# EAGLE design CO2 measurement module (EAGLE 5.03)
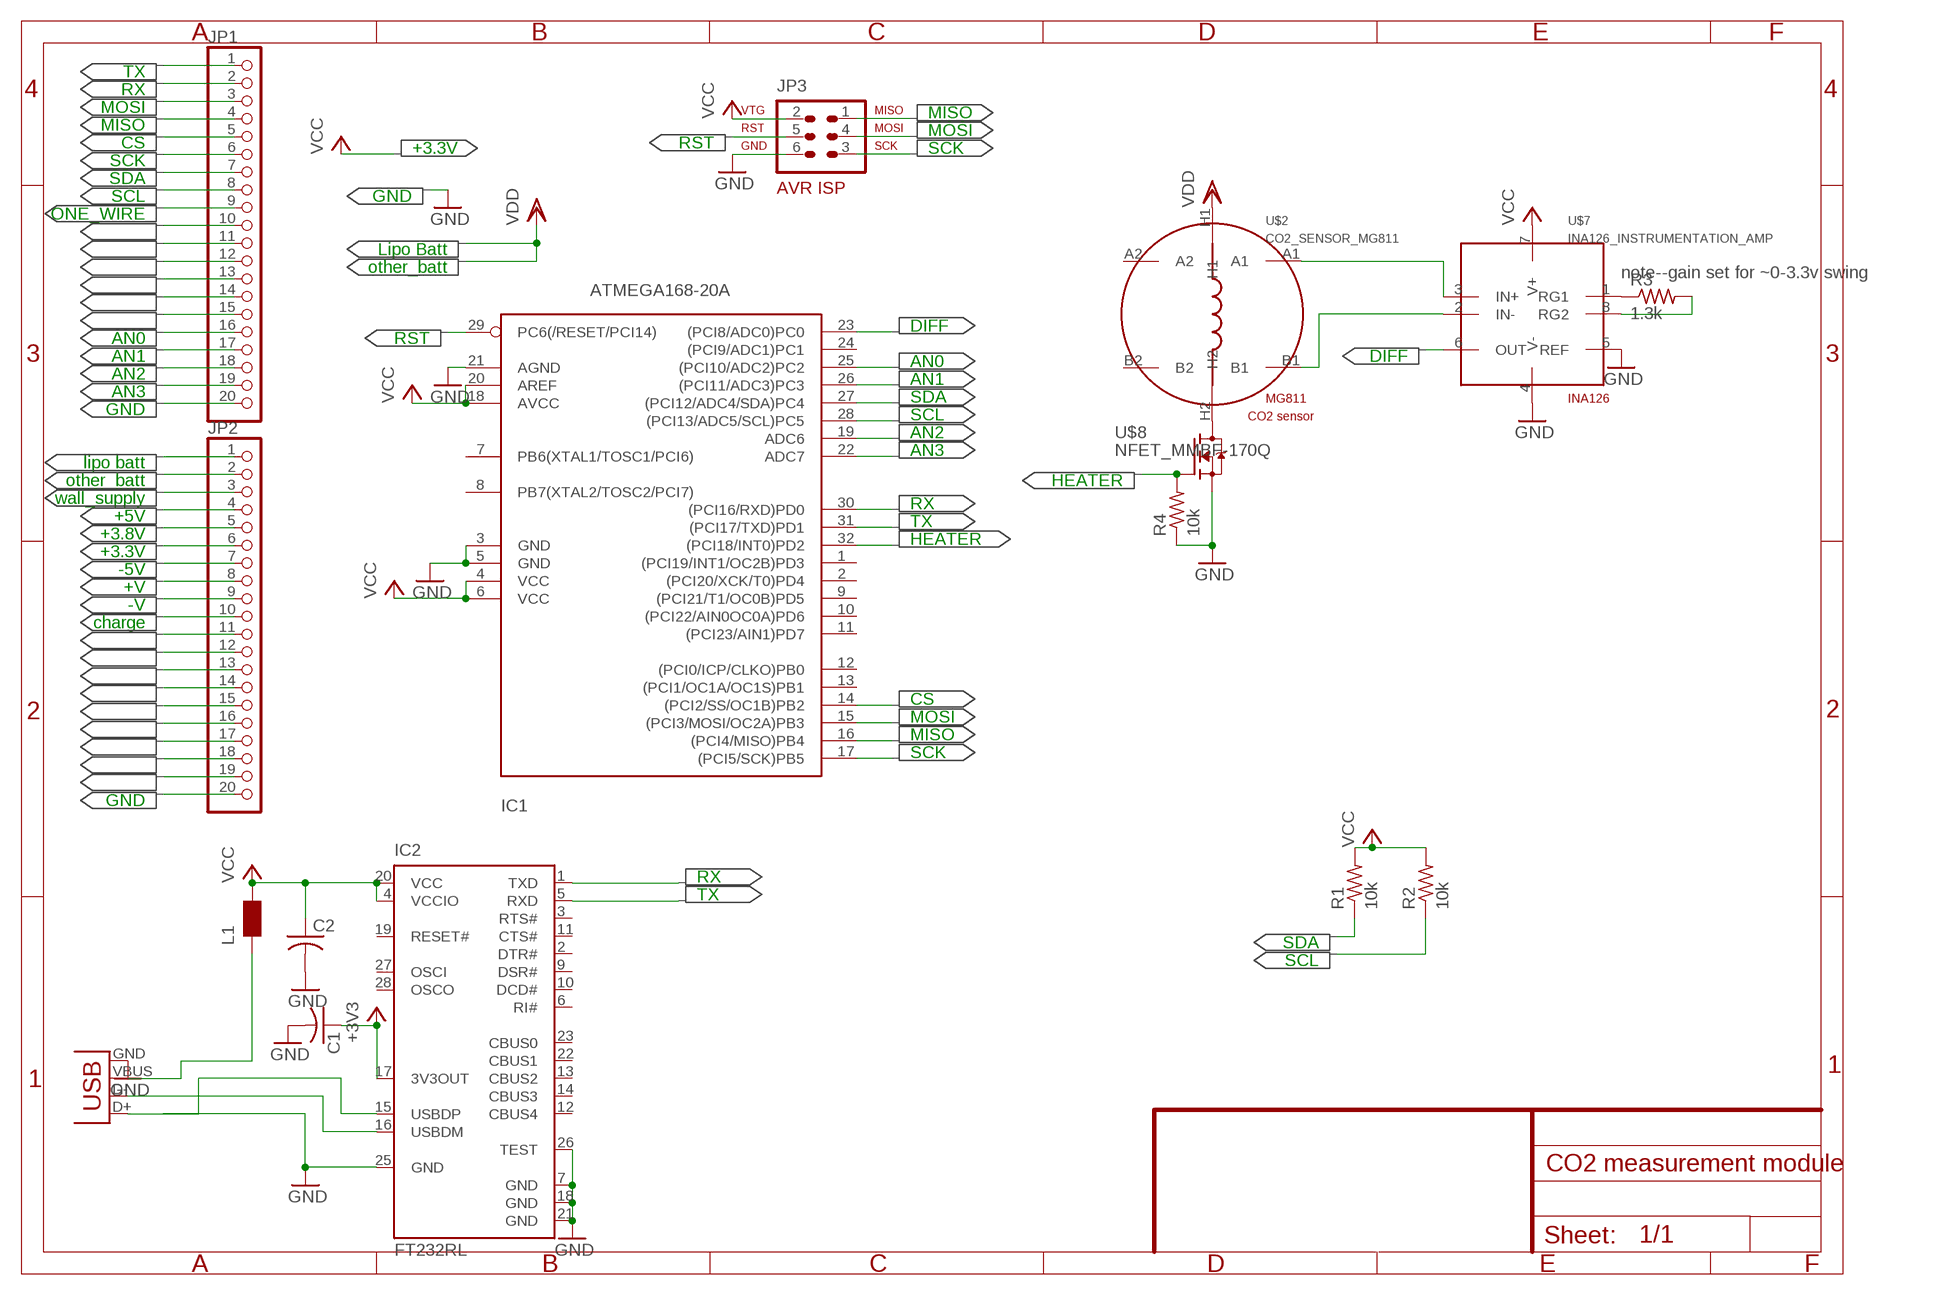
[diagram p0: schematic, sheet 1]

## Parts
C1  C-USC0603  [C0603]
C2  C-USC0603  [C0603]
IC1  ATMEGA168-20A  [TQFP32-08]
IC2  FT232RL  [SSOP28]
JP1  PINHD-1X20  [1X20]
JP2  PINHD-1X20  [1X20]
JP3  AVR-ISP-6  [AVR-ISP-6]
L1  WE-CBF_0603  [0603]
R1  10k  R-US_R0603  [R0603]
R2  10k  R-US_R0603  [R0603]
R3  1.3k  R-US_R0603  [R0603]
R4  10k  R-US_R0603  [R0603]
U$2  CO2_SENSOR_MG811  [MG811]
U$7  INA126_INSTRUMENTATION_AMP  [SO8]
U$8  NFET_MMBF-170Q  [SOT23]
X1  USBPTH  [USB-B-PTH]

## Nets
+3.3V: JP2.6
+3V3: C1.1 IC2.17(3V3OUT)
+5V: JP2.4
+V: JP2.8
-5V: JP2.7
-V: JP2.9
ALARM: JP1.14
AN0: IC1.25((PCI10/ADC2)PC2) JP1.16
AN1: IC1.26((PCI11/ADC3)PC3) JP1.17
AN2: IC1.19(ADC6) JP1.18
AN3: IC1.22(ADC7) JP1.19
CD: JP1.10
CHARGE: JP2.10
CS: IC1.14((PCI2/SS/OC1B)PB2) JP1.5
DIFF: IC1.23((PCI8/ADC0)PC0) U$7.6(OUT)
GND: C1.2 C2.2 IC1.3(GND) IC1.5(GND) IC1.21(AGND) IC2.7(GND) IC2.18(GND) IC2.21(GND) IC2.25(GND) IC2.26(TEST) JP1.20 JP2.20 JP3.6 R4.1 U$7.4(V-) U$7.5(REF) U$8.2(S) X1.GND
HEATER: IC1.32((PCI18/INT0)PD2) R4.2 U$8.1(G)
LOG: JP1.12
MISO: IC1.16((PCI4/MISO)PB4) JP1.4 JP3.1
MOSI: IC1.15((PCI3/MOSI/OC2A)PB3) JP1.3 JP3.4
N$1: JP2.11
N$2: U$2.A1 U$7.3(IN+)
N$3: U$2.B1 U$7.2(IN-)
N$5: R3.1 U$7.1(RG1)
N$6: JP2.12
N$7: JP2.13
N$8: IC2.15(USBDP) X1.D+
N$9: IC2.16(USBDM) X1.D-
N$11: JP2.14
N$12: JP2.15
N$13: JP2.16
N$14: JP2.17
N$15: JP2.18
N$16: JP2.19
N$17: R3.2 U$7.8(RG2)
N$18: U$2.H2 U$8.3(D)
N$19: L1.1 X1.VBUS
N$32: JP1.15
ONE_WIRE: JP1.9
RIN: JP1.13
RST: IC1.29(PC6(/RESET/PCI14)) JP3.5
RX: IC1.30((PCI16/RXD)PD0) IC2.1(TXD) JP1.2
SCK: IC1.17((PCI5/SCK)PB5) JP1.6 JP3.3
SCL: IC1.28((PCI13/ADC5/SCL)PC5) JP1.8 R2.1
SDA: IC1.27((PCI12/ADC4/SDA)PC4) JP1.7 R1.1
SW: JP1.11
TX: IC1.31((PCI17/TXD)PD1) IC2.5(RXD) JP1.1
VCC: C2.1 IC1.4(VCC) IC1.6(VCC) IC1.18(AVCC) IC1.20(AREF) IC2.4(VCCIO) IC2.20(VCC) JP2.5 JP3.2 L1.2 R1.2 R2.2 U$7.7(V+)
VDD: JP2.1 JP2.2 U$2.H1
WALL_SUPPLY: JP2.3
Unconnected: IC1.1((PCI19/INT1/OC2B)PD3) IC1.2((PCI20/XCK/T0)PD4) IC1.7(PB6(XTAL1/TOSC1/PCI6)) IC1.8(PB7(XTAL2/TOSC2/PCI7)) IC1.9((PCI21/T1/OC0B)PD5) IC1.10((PCI22/AIN0OC0A)PD6) IC1.11((PCI23/AIN1)PD7) IC1.12((PCI0/ICP/CLKO)PB0) IC1.13((PCI1/OC1A/OC1S)PB1) IC1.24((PCI9/ADC1)PC1) IC2.2(DTR#) IC2.3(RTS#) IC2.6(RI#) IC2.9(DSR#) IC2.10(DCD#) IC2.11(CTS#) IC2.12(CBUS4) IC2.13(CBUS2) IC2.14(CBUS3) IC2.19(RESET#) IC2.22(CBUS1) IC2.23(CBUS0) IC2.27(OSCI) IC2.28(OSCO) U$2.A2 U$2.B2

## Notes on the sheet
- TX
- RX
- MOSI
- MISO | MISO
- CS | RST | MOSI
- SCK | +3.3V | SCK
- SDA
- SCL | GND
- ONE_WIRE
- Lipo Batt
- other_batt
- note--gain set for ~0-3.3v swing
- AN0 | RST | DIFF
- AN1 | DIFF
- AN2 | AN0
- AN3 | AN1
- GND | SDA
- SCL
- AN2
- lipo batt | AN3
- other_batt | HEATER
- wall_supply
- +5V | RX
- +3.8V | TX
- +3.3V | HEATER
- -5V
- +V
- -V
- charge
- CS
- MOSI
- MISO
- SCK
- GND
- RX
- TX
- SDA
- SCL

## Library data of the parts
C1 C2 = rcl:C-US: CAPACITOR, American symbol
IC1 = avr:ATMEGA168: MICROCONTROLLER 16 kBytes FLASH 1 kBytes SRAM 512 Bytes EEPROM USART 8-channel 10 bit ADC
IC2 = ftdichip:FT232R: Source: http://www.ftdichip.com/Documents/DataSheets/DS_FT232R_v104.pdf
JP1 JP2 = pinhead:PINHD-1X20: PIN HEADER
JP3 = atmel-1:AVR-ISP-6: AVR ISP-6 Serial Programming Header
L1 = wuerth-elektronik:WE-CBF: SMD EMI Suppression Ferrite Beads - excellent anti-EMI properties - low DCR - impedances till 3000 ohms - rated current up to 6 A
R1-R4 = rcl:R-US_: RESISTOR, American symbol
U$2 = nublabs:CO2_SENSOR_MG811: MG811 sensor, from HWsensor (hwsensor.com)
U$7 = nublabs:INA126_INSTRUMENTATION_AMP: INA126 is a low-power instrumentation amplifier. Gain is set by Rg @ 5+80k/Rg
U$8 = nublabs:NFET_MMBF-170Q
X1 = SparkFun:USB: USB Connectors USB-B-PTH is fully proven SKU : PRT-00139 USB-miniB is fully proven SKU : PRT-00587 USB-A-PCB is untested. USB-A-H is throughly reviewed, but untested. Spark Fun Electronics SKU : PRT-00437 USB-B-SMT is throughly reviewed, but untested. Needs silkscreen touching up. USB-A-S has not been used/tested USB-MB-H has not been used/tested

## Board
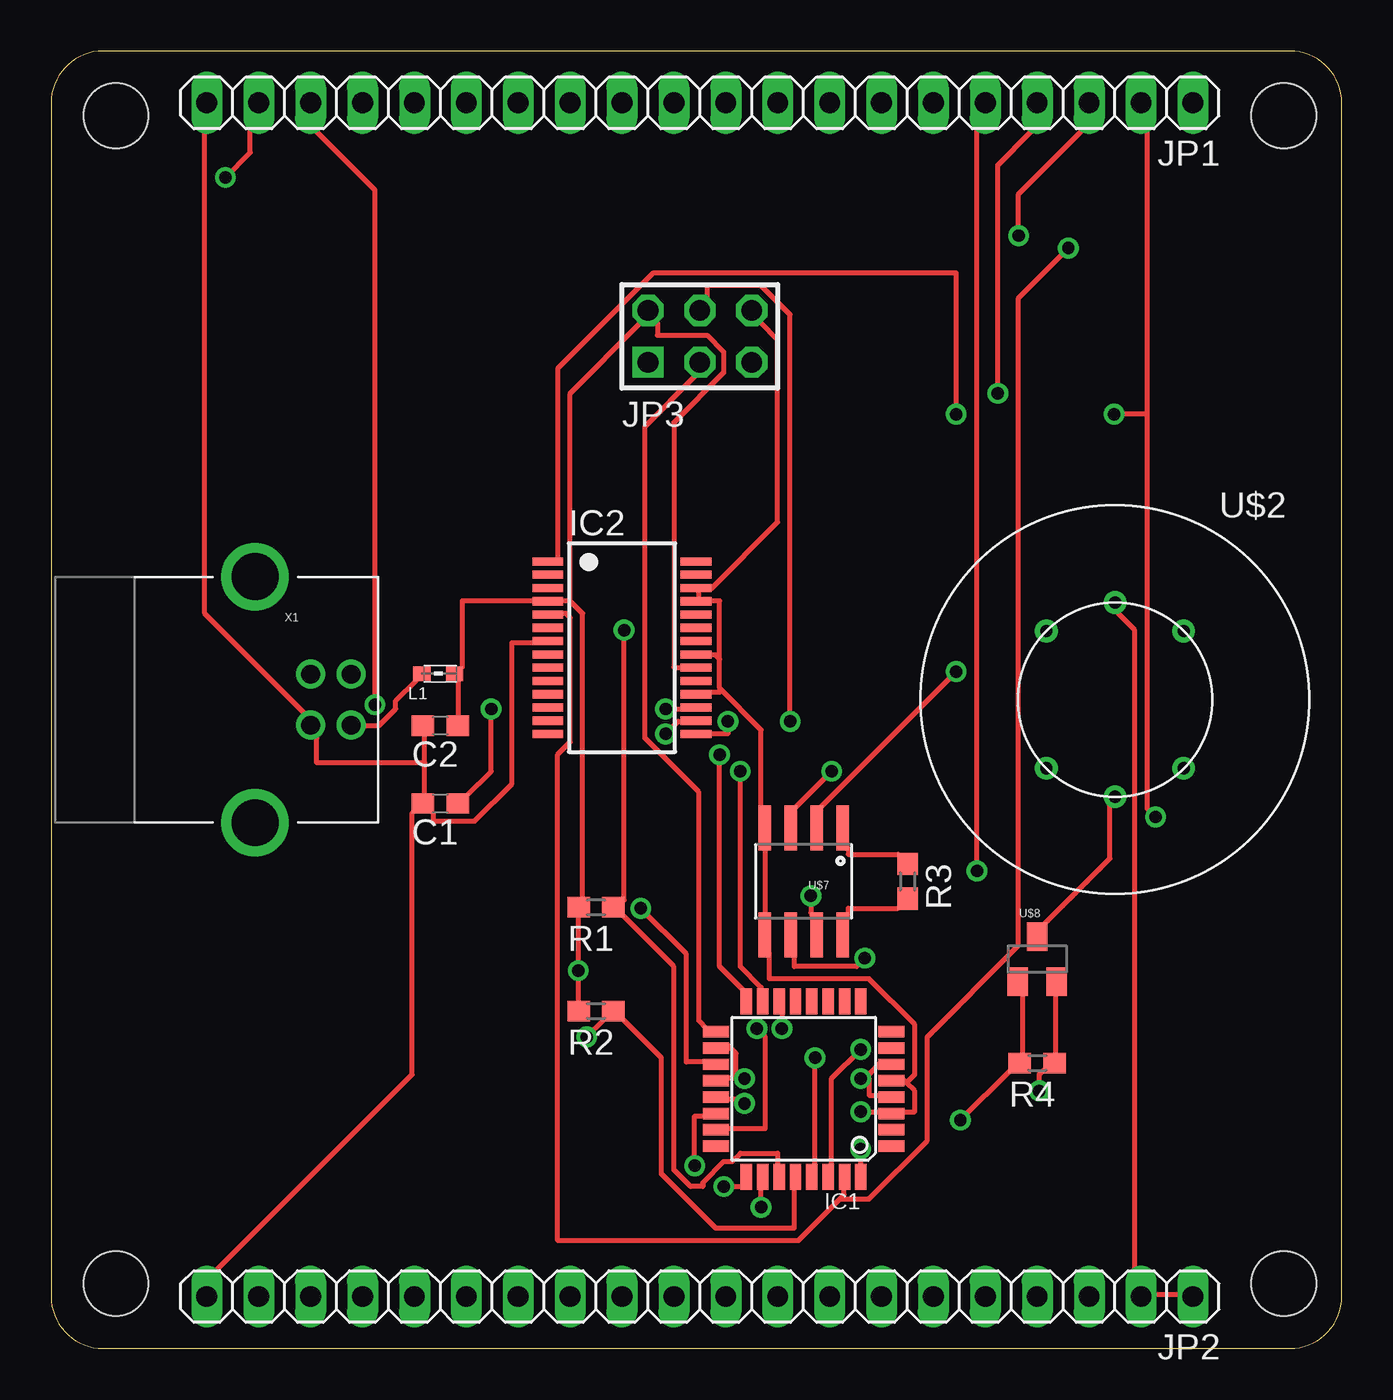
[diagram p1: board, top side]
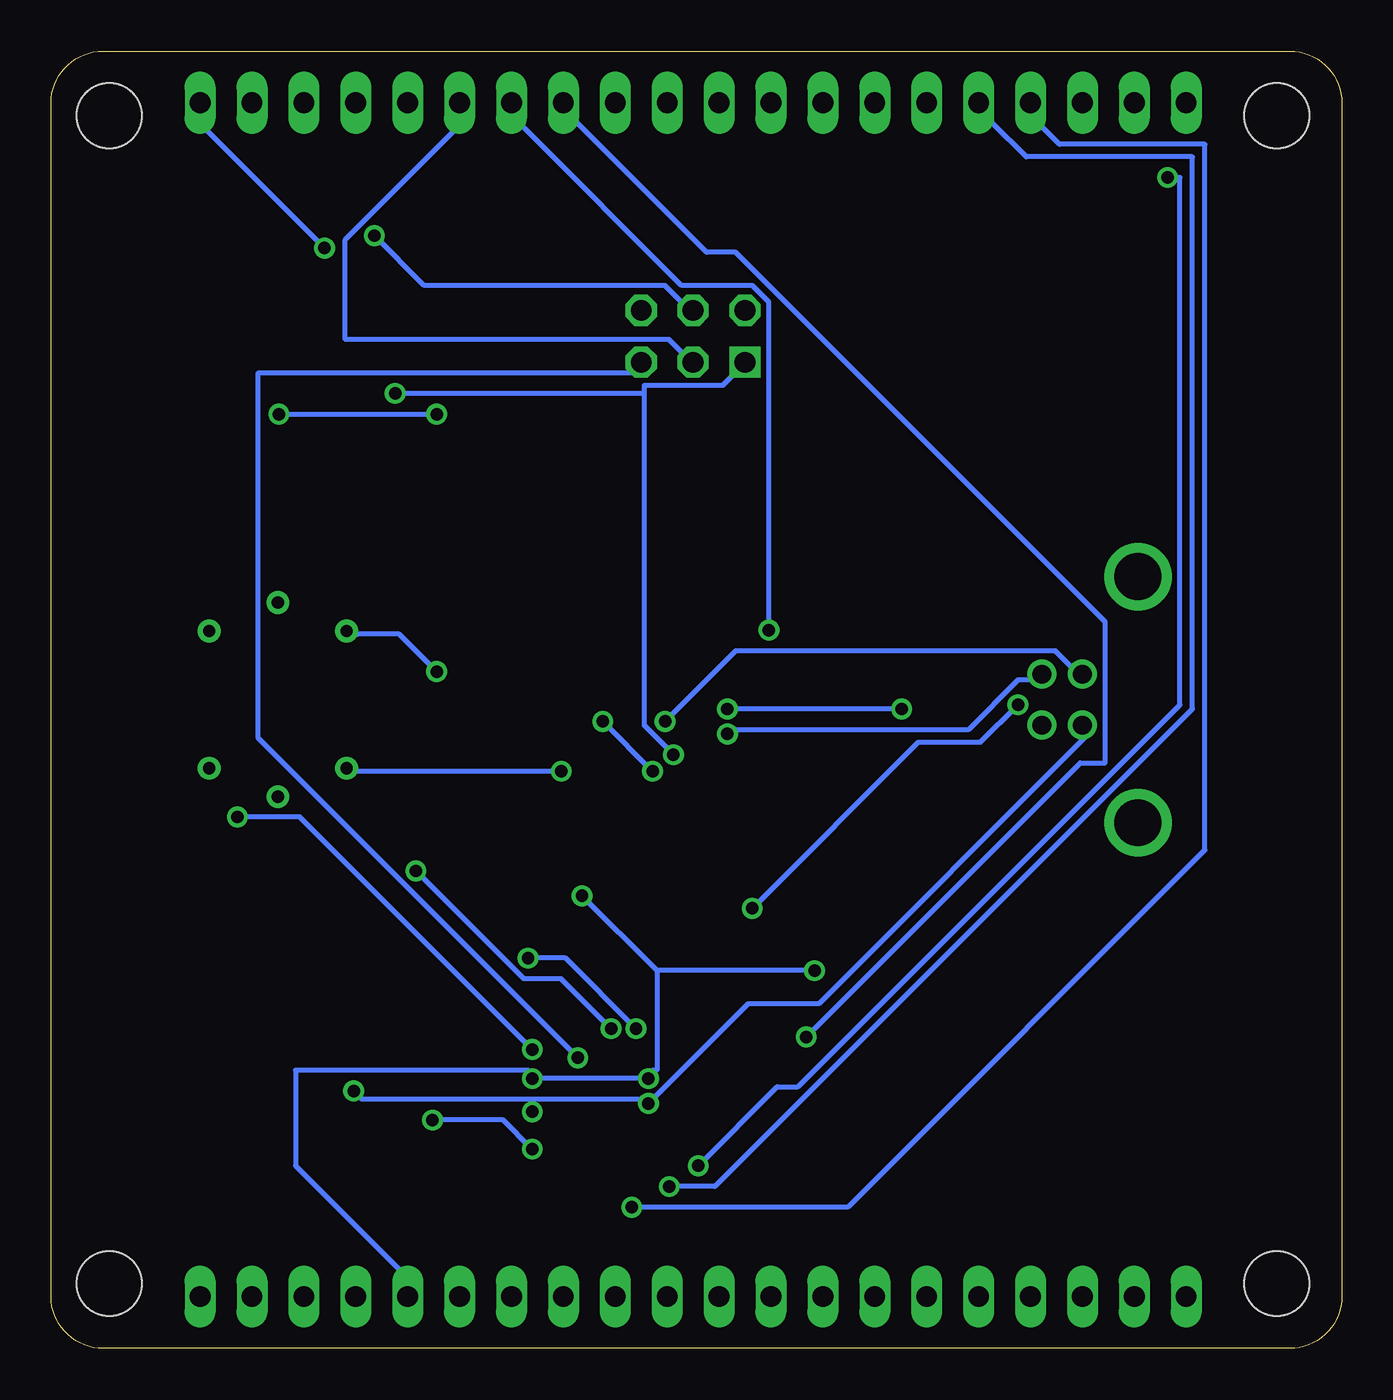
[diagram p2: board, bottom side, seen from below]

Size 63.17 x 63.49 mm. Coordinates in mm from the lower left corner, seen from the top.
Outline: 60.63,0 arc90 63.17,2.54 63.17,60.95 arc90 60.63,63.49 2.54,63.49 arc90 0,60.95 0,2.54 arc90 2.54,0 60.63,0
Copper layers (1*16): Top 0.035mm / dielectric 1.5mm / Bottom 0.035mm
Design rules "default": minimum track width 10mil, minimum drill 24mil, track to track 8mil, track to pad 8mil, pad to pad 8mil, via to via 8mil, smd to smd 8mil, copper to edge 40mil, drill to drill 8mil, minimum pad ring 10mil, minimum via ring 8mil, stop-mask expansion 4mil, vias tented up to drill 0mil, thermal gap 10mil
Holes 3.17 mm at 3.17,3.17 60.33,3.17 60.33,60.33 3.17,60.33

### Footprints (pad centres in the part's own frame; a part is rotated, then mirrored left to right if it is on the bottom)
C0603 = smd 1.1 x 1: 1 -0.85,0; 2 0.85,0
TQFP32-08 = smd 1.27 x 0.559: 1 -4.293,2.8; 2 -4.293,2; 3 -4.293,1.2; 4 -4.293,0.4; 5 -4.293,-0.4; 6 -4.293,-1.2; 7 -4.293,-2; 8 -4.293,-2.8; 17 4.293,-2.8; 18 4.293,-2; 19 4.293,-1.2; 20 4.293,-0.4; 21 4.293,0.4; 22 4.293,1.2; 23 4.293,2; 24 4.293,2.8 | smd 0.559 x 1.27: 9 -2.8,-4.293; 10 -2,-4.293; 11 -1.2,-4.293; 12 -0.4,-4.293; 13 0.4,-4.293; 14 1.2,-4.293; 15 2,-4.293; 16 2.8,-4.293; 25 2.8,4.293; 26 2,4.293; 27 1.2,4.293; 28 0.4,4.293; 29 -0.4,4.293; 30 -1.2,4.293; 31 -2,4.293; 32 -2.8,4.293
SSOP28 = smd 0.4 x 1.5: 1 -4.225,-3.625; 2 -3.575,-3.625; 3 -2.925,-3.625; 4 -2.275,-3.625; 5 -1.625,-3.625; 6 -0.975,-3.625; 7 -0.325,-3.625; 8 0.325,-3.625; 9 0.975,-3.625; 10 1.625,-3.625; 11 2.275,-3.625; 12 2.925,-3.625; 13 3.575,-3.625; 14 4.225,-3.625; 15 4.225,3.625; 16 3.575,3.625; 17 2.925,3.625; 18 2.275,3.625; 19 1.625,3.625; 20 0.975,3.625; 21 0.325,3.625; 22 -0.325,3.625; 23 -0.975,3.625; 24 -1.625,3.625; 25 -2.275,3.625; 26 -2.925,3.625; 27 -3.575,3.625; 28 -4.225,3.625
1X20 = drill 1.016 long: 1 -24.13,0; 2 -21.59,0; 3 -19.05,0; 4 -16.51,0; 5 -13.97,0; 6 -11.43,0; 7 -8.89,0; 8 -6.35,0; 9 -3.81,0; 10 -1.27,0; 11 1.27,0; 12 3.81,0; 13 6.35,0; 14 8.89,0; 15 11.43,0; 16 13.97,0; 17 16.51,0; 18 19.05,0; 19 21.59,0; 20 24.13,0
AVR-ISP-6 = drill 1.016 square: 1 -2.54,-1.27 | drill 1.016 octagon: 2 -2.54,1.27; 3 0,-1.27; 4 0,1.27; 5 2.54,-1.27; 6 2.54,1.27
0603 = smd 0.85 x 0.7: 1 -0.9,0; 2 0.7,0
R0603 = smd 1.1 x 1: 1 -0.85,0; 2 0.85,0
MG811 = drill 0.6 round: A1 -3.36,-3.36; A2 3.36,-3.36; B1 -3.36,3.36; B2 3.36,3.36; H1 0,4.75; H2 0,-4.75
SO8 = smd 0.61 x 2.21: 1 -1.905,-2.616; 2 -0.635,-2.616; 3 0.635,-2.616; 4 1.905,-2.616; 5 1.905,2.616; 6 0.635,2.616; 7 -0.635,2.616; 8 -1.905,2.616
SOT23 = smd 1 x 1.4: 1 -0.95,-1.1; 2 0.95,-1.1; 3 0,1.1
USB-B-PTH = drill 0.914 round: D+ 0,1.25; D- 1.981,1.25; GND 0,-1.25; VBUS 1.981,-1.25 | drill 2.286 round: P$1 -2.718,-6.02; P$2 -2.718,6.02

### Placement (x,y rotation side)
C1  19.05,26.67 180 top
C2  19.05,30.48 180 top
IC1  36.83,12.7 180 top
IC2  27.94,34.29 270 top
JP1  31.75,60.96 180 top
JP2  31.75,2.54 180 top
JP3  31.75,49.53 0 top
L1  19.05,33.02 0 top
R1  26.67,21.59 180 top
R2  26.67,16.51 180 top
R3  41.91,22.86 270 top
R4  48.26,13.97 180 top
U$2  52.07,31.75 0 top
U$7  36.83,22.86 180 top
U$8  48.26,19.05 0 top
X1  12.7,31.75 0 top

### Tracks (layer width: path | path; a pad name or v marks a point on that pad's centre or on a via)
+3V3  (via drill 0.61)
  Top 0.254: v21.54,31.29 21.54,28.25 20.32,27.03 C1.1 | v30.07,31.29 30.89,31.29 IC2.17
  Bottom 0.254: v21.54,31.29 v30.07,31.29
AN0  (via drill 0.61)
  Top 0.254: v32.92,7.92 33.93,7.92 IC1.25
  Bottom 0.254: v32.92,7.92 30.68,7.92 7.32,31.29 7.32,58.32 15.44,58.32 17.07,59.94 JP1.16
AN1  (via drill 0.61)
  Top 0.254: v34.75,6.91 34.75,7.92 IC1.26
  Bottom 0.254: v34.75,6.91 24.18,6.91 6.71,24.38 6.71,58.93 13.82,58.93 14.63,59.74 JP1.17
AN2  (via drill 0.61)
  Top 0.254: v28.85,21.54 31.09,19.3 31.09,14.02 32.11,14.02 IC1.19 | v15.85,31.5 15.85,56.69 13.01,59.54 JP1.18
  Bottom 0.254: v28.85,21.54 20.73,29.67 17.68,29.67 v15.85,31.5
AN3  (via drill 0.61)
  Top 0.254: v31.5,8.94 31.5,11.38 32.11,11.38 IC1.22 | v8.53,57.3 9.75,58.52 9.75,59.54 JP1.19
  Bottom 0.254: v31.5,8.94 27.64,12.8 26.62,12.8 7.92,31.5 7.92,57.3 v8.53,57.3
CS  (via drill 0.61)
  Top 0.254: v35.76,15.65 35.76,16.46 IC1.14 | v45.31,23.37 45.31,59.54 JP1.5
  Bottom 0.254: v35.76,15.65 38.2,18.09 40.03,18.09 v45.31,23.37
DIFF  (via drill 0.61)
  Top 0.254: v34.54,15.65 34.95,15.24 34.95,10.77 33.12,10.77 IC1.23 | v39.83,19.1 39.42,18.69 36.37,18.69 36.37,19.3 U$7.6
  Bottom 0.254: v34.54,15.65 38,19.1 v39.83,19.1
GND  (via drill 0.61)
  Top 0.254: 18.29,28.65 18.29,30.07 C2.2 | 18.29,28.65 18.29,27.03 C1.2 | IC2.7 23.57,34.54 22.55,34.54 22.55,27.64 20.73,25.81 18.69,25.81 18.69,26.21 C1.2 | JP2.20 8.13,3.86 17.68,13.41 17.68,26.21 C1.2 | 41.86,13.01 41.66,13.21 IC1.5 | 41.86,13.01 42.27,12.6 42.27,11.58 41.66,11.58 IC1.3 40.64,11.58 v39.62,11.58 | 41.86,13.01 42.27,13.41 42.27,15.85 40.03,18.09 35.15,18.09 35.15,19.3 U$7.5 34.95,21.34 34.95,24.38 U$7.4 34.75,26.42 34.75,30.28 32.72,32.31 | 32.72,32.31 32.72,33.73 | 32.72,32.31 32.72,32.11 32.31,32.11 IC2.18 | 32.72,33.73 32.51,33.93 32.31,33.93 IC2.21 | 32.72,33.73 32.72,36.58 32.31,36.58 IC2.25 31.7,36.58 31.7,37.19 IC2.26 32.31,37.19 35.56,40.44 35.56,49.38 34.75,50.19 JP3.6 | U$8.2 49.17,17.27 49.17,14.43 R4.1 48.56,13.61 48.36,13.41 v48.36,12.6 | v33.93,11.99 33.93,12.19 33.12,12.19 IC1.21 | JP1.20 7.52,59.54 7.52,35.97 12.39,31.09 X1.GND 13.01,29.87 13.01,28.65 18.29,28.65
  Bottom 0.254: X1.GND 12.6,29.87 25.6,16.87 29.06,16.87 v33.93,11.99 34.34,12.19 39.62,12.19 | v48.36,12.6 47.95,12.19 39.62,12.19 | 39.62,12.19 v39.62,11.58
HEATER  (via drill 0.61)
  Top 0.254: U$8.1 47.55,17.27 47.55,14.43 R4.2 46.94,13.61 v44.5,11.18 | v39.62,9.75 39.62,8.94 IC1.32
  Bottom 0.254: v39.62,9.75 41.05,11.18 v44.5,11.18
MISO  (via drill 0.61)
  Top 0.254: v32.72,29.06 32.72,18.69 33.93,17.48 IC1.16 | v46.33,46.74 46.33,57.91 47.95,59.54 JP1.4
  Bottom 0.254: v32.72,29.06 34.14,30.48 34.14,46.74 | 34.14,46.74 34.14,47.14 30.28,47.14 29.87,47.55 JP3.1 | 34.14,46.74 v46.33,46.74
MOSI  (via drill 0.61)
  Top 0.254: v33.73,28.25 33.73,18.69 34.75,17.68 34.75,17.48 IC1.15 | v36.17,30.68 36.17,50.6 34.75,52.02 32.11,52.02 32.11,51.41 JP3.4 | v47.35,54.46 47.35,56.49 50.39,59.54 JP1.3
  Bottom 0.254: v33.73,28.25 v36.17,30.68 | v47.35,54.46 44.91,52.02 33.12,52.02 32.31,51.21 JP3.4
N$2  (via drill 0.61)
  Top 0.254: v38.2,28.25 36.37,26.42 U$7.3
  Bottom 0.254: v38.2,28.25 48.16,28.25 U$2.A1
N$3  (via drill 0.61)
  Top 0.254: v44.3,33.12 37.59,26.42 U$7.2
  Bottom 0.254: v44.3,33.12 46.13,34.95 48.16,34.95 U$2.B1
N$5
  Top 0.254: R3.1 41.45,24.18 39.01,24.18 39.01,24.38 U$7.1
N$8  (via drill 0.61)
  Top 0.254: v33.12,30.68 33.12,30.07 32.31,30.07 IC2.15
  Bottom 0.254: v33.12,30.68 29.67,34.14 14.02,34.14 13.21,33.33 X1.D+
N$9  (via drill 0.61)
  Top 0.254: v30.07,30.07 30.68,30.68 30.89,30.68 IC2.16
  Bottom 0.254: v30.07,30.07 29.87,30.28 18.29,30.28 15.85,32.72 15.24,32.72 X1.D-
N$17
  Top 0.254: R3.2 41.45,21.54 39.01,21.54 39.01,21.34 U$7.8
N$18
  Top 0.254: U$8.3 48.56,20.73 51.82,23.98 51.82,26.62 U$2.H2
N$19
  Top 0.254: L1.1 17.88,32.72 16.87,31.7 16.87,31.29 16.05,30.48 15.24,30.48 X1.VBUS
RST  (via drill 0.61)
  Top 0.254: v37.39,14.22 37.39,8.94 IC1.29
  Bottom 0.254: v37.39,14.22 53.03,29.87 53.03,47.75 34.75,47.75 JP3.5
RX  (via drill 0.61)
  Top 0.254: v39.62,14.63 38.2,13.21 38.2,8.94 IC1.30 | v54.05,26.01 53.65,26.42 53.65,45.72 | 53.65,45.72 53.65,59.54 JP1.2 | v44.3,45.72 44.3,52.63 29.46,52.63 24.79,47.95 24.79,38.61 IC2.1 | 53.65,45.72 v52.02,45.72
  Bottom 0.254: v39.62,14.63 51,26.01 v54.05,26.01 | v52.02,45.72 v44.3,45.72
SCK
  Top 0.254: IC1.17 32.11,15.65 31.7,16.05 31.7,27.23 29.06,29.87 29.06,45.11 31.5,47.55 JP3.3
  Bottom 0.254: JP1.6 43.48,59.54 48.77,54.25 48.77,49.38 32.92,49.38 32.31,48.77 JP3.3
SCL  (via drill 0.61)
  Top 0.254: IC1.28 36.37,7.92 36.37,5.89 32.51,5.89 29.87,8.53 29.87,14.22 28.04,16.05 R2.1 27.03,16.05 v26.21,15.24
  Bottom 0.254: v26.21,15.24 12.8,28.65 11.58,28.65 11.58,35.56 29.67,53.65 31.09,53.65 37.39,59.94 JP1.8
SDA  (via drill 0.61)
  Top 0.254: IC1.27 35.56,8.94 35.56,9.55 33.73,9.55 33.33,9.14 32.92,9.14 31.9,8.13 31.9,7.92 31.29,7.92 30.48,8.74 30.48,18.69 28.04,21.13 R1.1 28.04,21.95 v28.04,35.15
  Bottom 0.254: v28.04,35.15 28.04,51.21 28.85,52.02 32.31,52.02 40.03,59.74 JP1.7
TX  (via drill 0.61)
  Top 0.254: 38.61,7.32 36.58,5.28 24.79,5.28 24.79,29.06 25.4,29.67 25.4,35.76 25.2,35.97 24.99,35.97 IC2.5 | 38.61,7.32 38.81,7.52 38.81,7.92 IC1.31 | v49.78,53.85 47.35,51.41 47.35,19.71 42.88,15.24 42.88,10.16 40.03,7.32 38.61,7.32
  Bottom 0.254: v49.78,53.85 55.47,59.54 JP1.1
VCC  (via drill 0.61)
  Top 0.254: 33.53,13.21 33.12,13.21 IC1.20 | 33.53,13.21 33.53,14.43 33.12,14.83 IC1.18 | 40.03,13.21 40.03,13.41 40.64,14.02 IC1.6 | 40.03,13.21 40.03,12.39 40.64,12.39 IC1.4 | v33.93,13.21 33.53,13.21 | v39.62,13.21 40.03,13.21 | v37.19,22.15 37.19,21.34 U$7.7 | IC2.20 30.89,33.33 30.48,33.33 30.48,45.31 32.92,47.75 32.92,48.77 32.11,49.58 29.67,49.58 29.67,50.19 JP3.2 28.85,50.19 25.4,46.74 25.4,36.58 | R2.2 25.81,16.87 v25.81,18.49 25.81,21.13 R1.2 26.01,21.95 26.01,35.97 25.4,36.58 | C2.1 19.91,30.89 19.91,32.72 L1.2 20.12,33.33 20.12,36.58 23.57,36.58 IC2.4 24.99,36.58 25.4,36.58
  Bottom 0.254: 33.53,18.49 v37.19,22.15 | 33.53,18.49 33.53,13.61 33.73,13.61 v33.93,13.21 v39.62,13.21 39.83,13.61 51.21,13.61 51.21,8.94 46.13,3.86 JP2.5 | v25.81,18.49 33.53,18.49
VDD
  Top 0.254: U$2.H1 52.22,35.97 53.03,35.15 53.03,3.86 JP2.2 54.05,2.64 55.27,2.64 JP2.1